# EAGLE design lpc1768 (EAGLE 6.4)
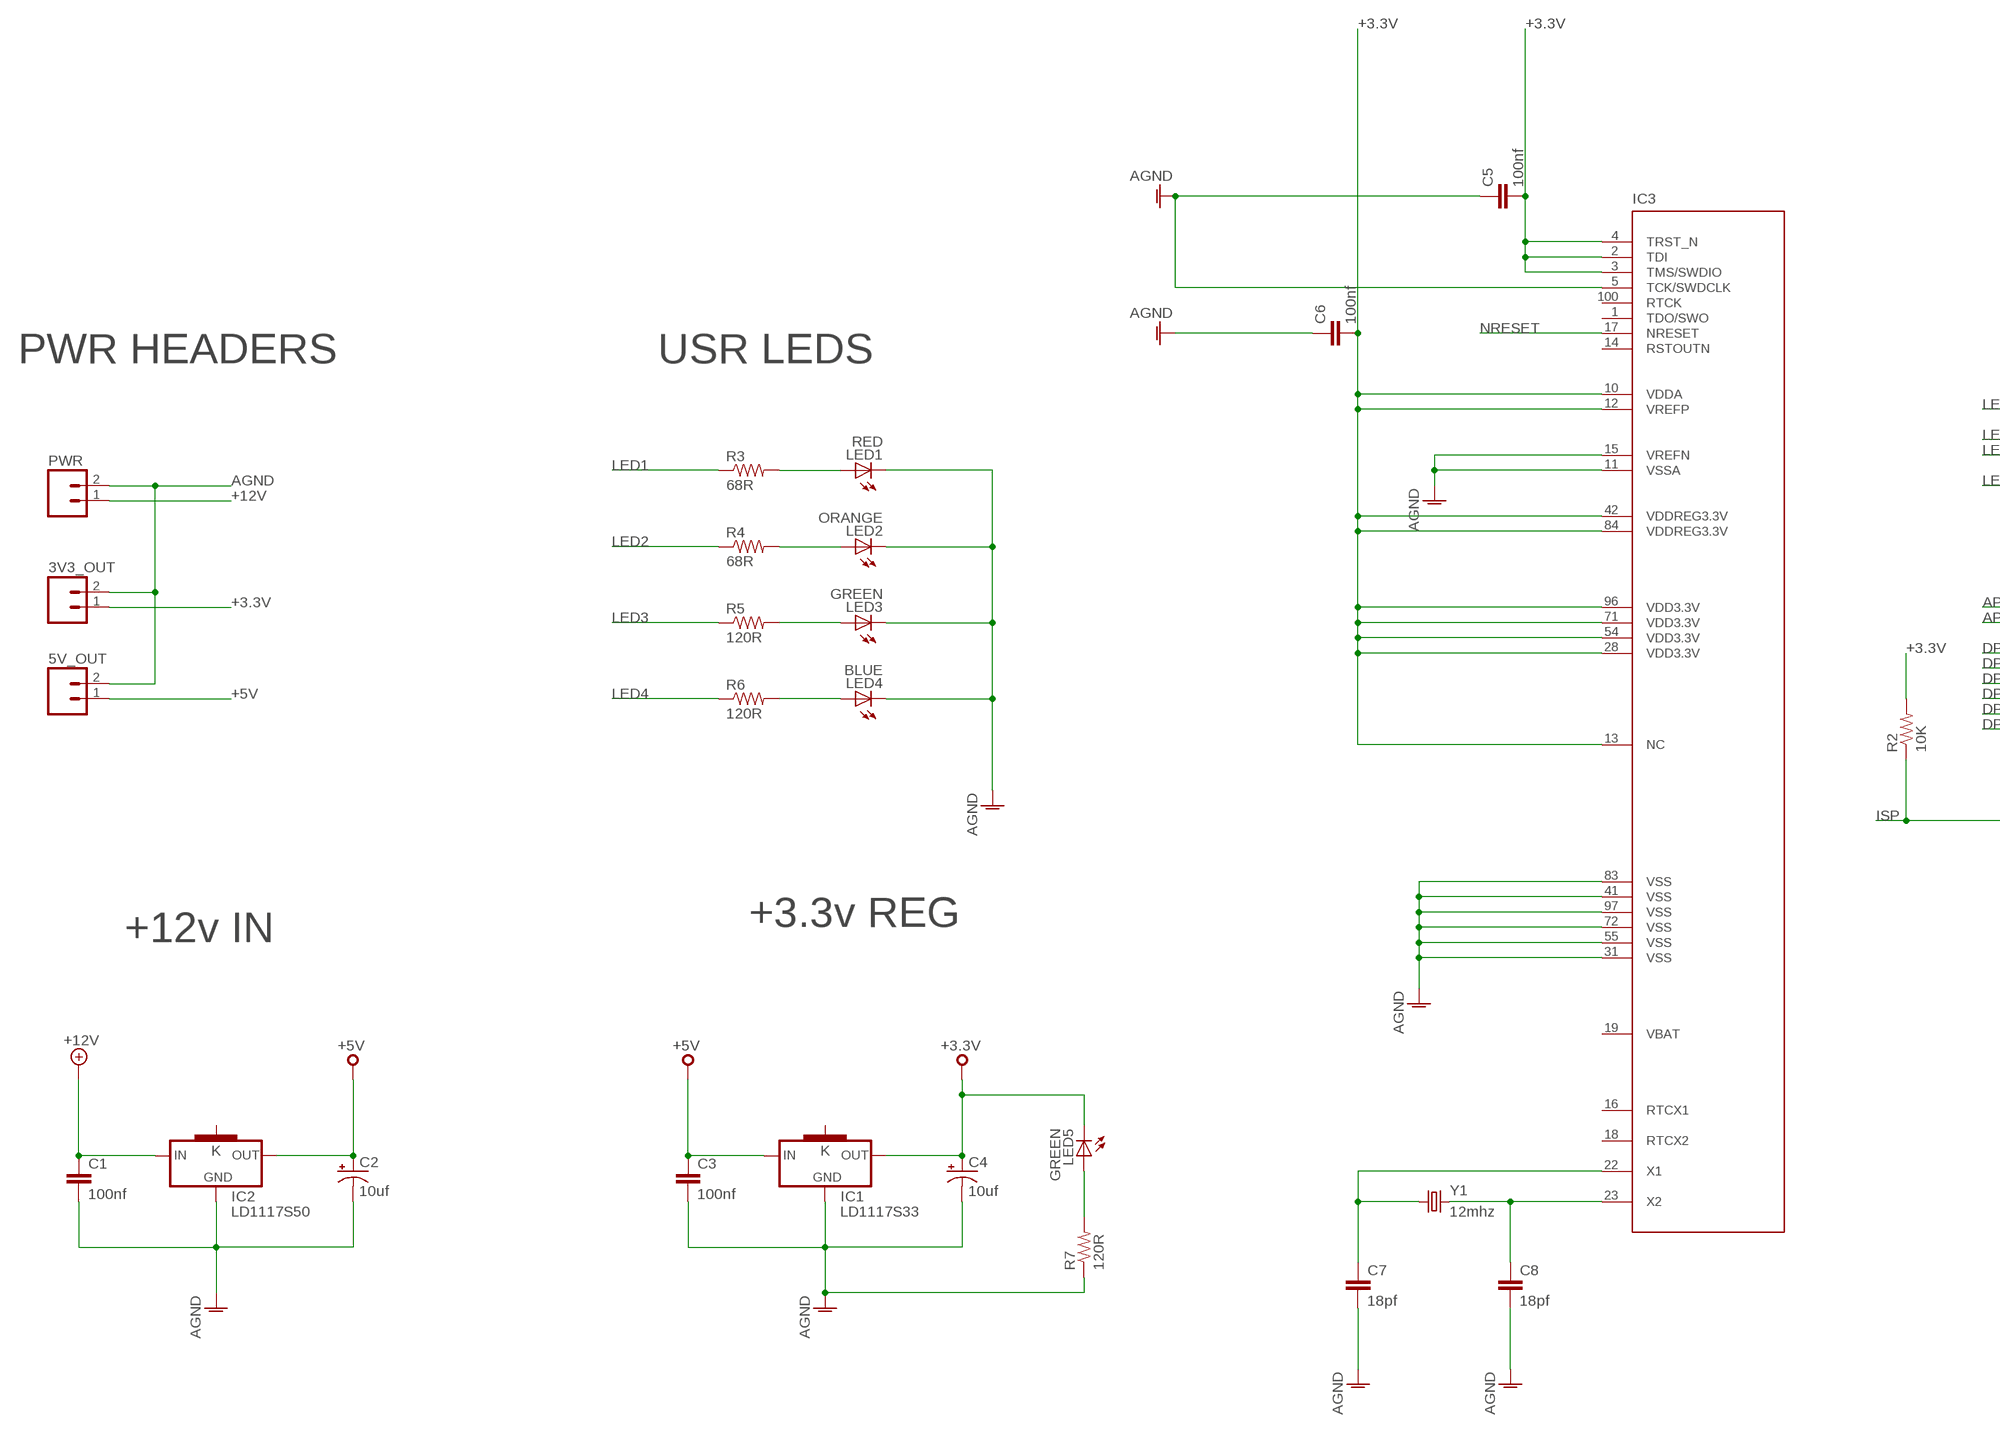
[diagram p0: schematic, sheet 1, part 1 of 2]
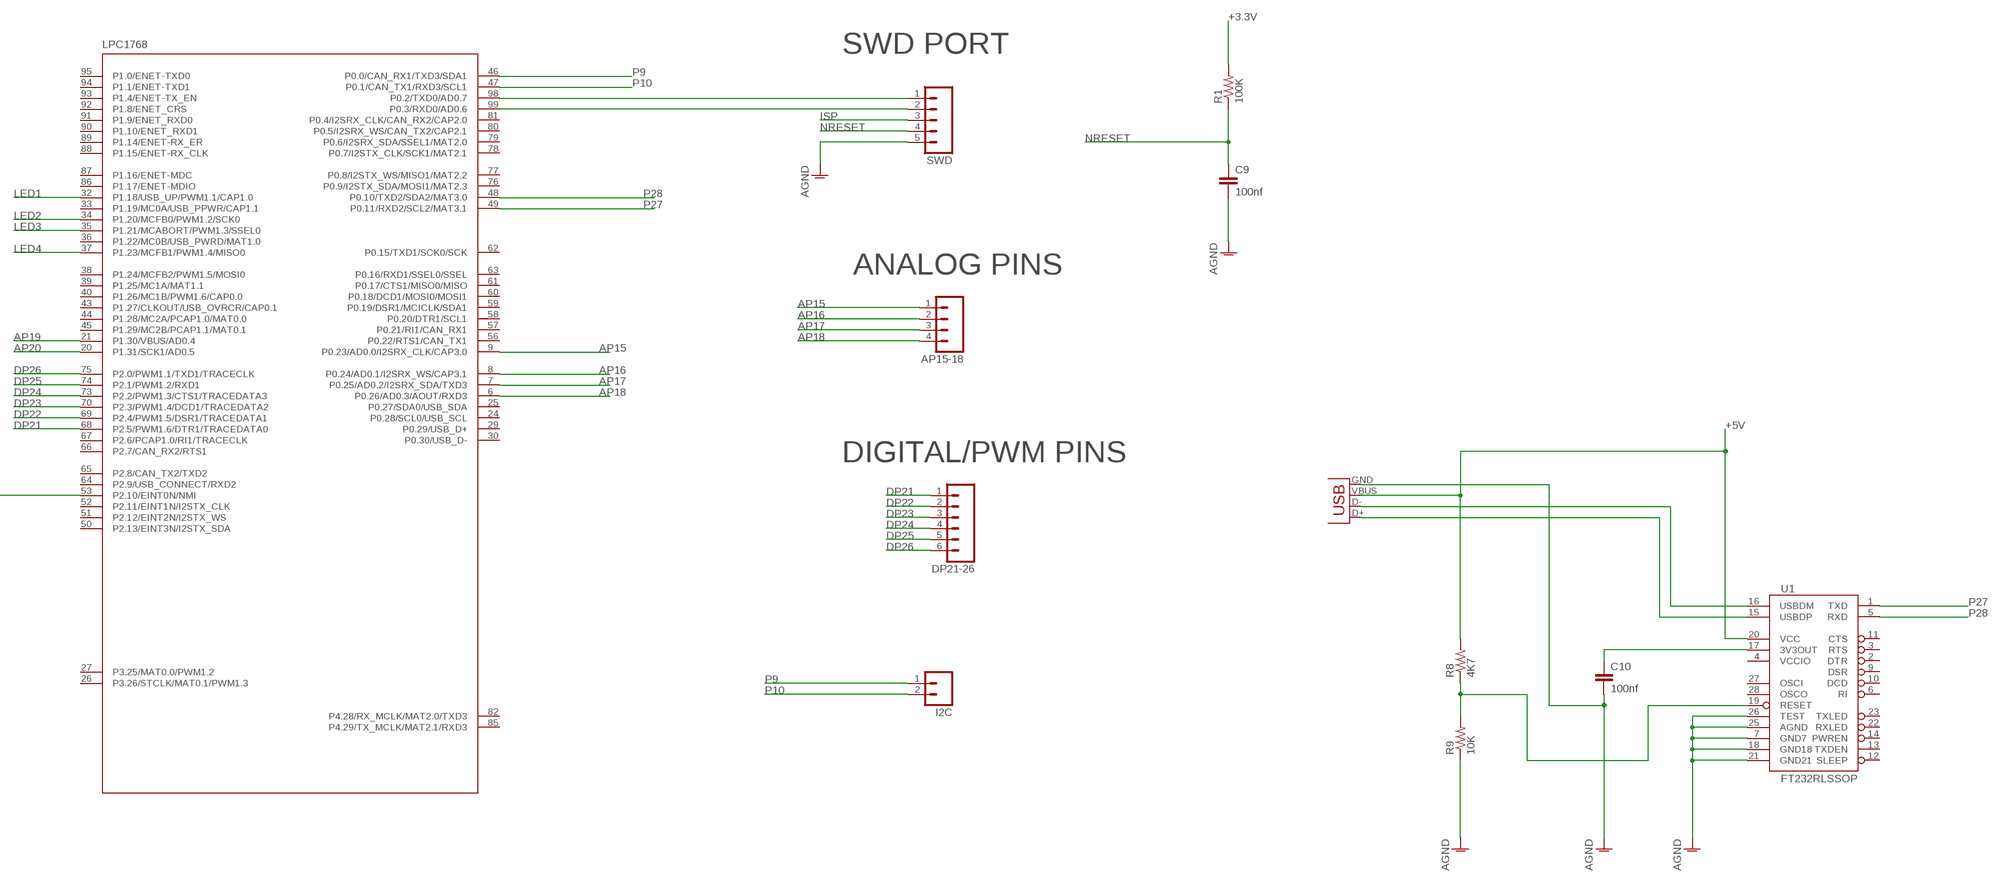
[diagram p1: schematic, sheet 1, part 2 of 2]

## Parts
3V3_OUT  M02PTH3  [1X02_LONGPADS]
5V_OUT  M02PTH3  [1X02_LONGPADS]
AP15-18  M04LONGPADS  [1X04_LONGPADS]
C1  100nf  CAP1206  [1206]
C2  10uf  CAP_POL1206-KIT  [EIA3216-KIT]
C3  100nf  CAP1206  [1206]
C4  10uf  CAP_POL1206-KIT  [EIA3216-KIT]
C5  100nf  CAP1206  [1206]
C6  100nf  CAP1206  [1206]
C7  18pf  CAP1206  [1206]
C8  18pf  CAP1206  [1206]
C9  100nf  CAP1206  [1206]
C10  100nf  CAP1206  [1206]
DP21-26  M06LONGPADS  [1X06_LONGPADS]
I2C  M02PTH3  [1X02_LONGPADS]
IC1  LD1117S33  [SOT223]
IC2  LD1117S50  [SOT223]
IC3  LPC1768  [LQFP100]
LED1  RED  LED1206  [LED-1206]
LED2  ORANGE  LED1206  [LED-1206]
LED3  GREEN  LED1206  [LED-1206]
LED4  BLUE  LED1206  [LED-1206]
LED5  GREEN  LED1206  [LED-1206]
PWR  M02PTH3  [1X02_LONGPADS]
R1  100K  RESISTOR1206  [1206]
R2  10K  RESISTOR1206  [1206]
R3  68R  RESISTOR1206  [1206]
R4  68R  RESISTOR1206  [1206]
R5  120R  RESISTOR1206  [1206]
R6  120R  RESISTOR1206  [1206]
R7  120R  RESISTOR1206  [1206]
R8  4K7  RESISTOR1206  [1206]
R9  10K  RESISTOR1206  [1206]
SWD  M05PTH_LONGPADS  [1X05_LONGPADS]
U1  FT232RLSSOP  [SSOP28DB]
X1  USB-MB-S  [USB-MB-S]
Y1  12mhz  CRYSTAL5X3  [CRYSTAL-SMD-5X3]

## Nets
+3.3V: 3V3_OUT.1 C4.A(+) C5.2 C6.2 IC1.2(OUT) IC3.2(TDI) IC3.3(TMS/SWDIO) IC3.4(TRST_N) IC3.10(VDDA) IC3.12(VREFP) IC3.13(NC) IC3.28(VDD3.3V) IC3.42(VDDREG3.3V) IC3.54(VDD3.3V) IC3.71(VDD3.3V) IC3.84(VDDREG3.3V) IC3.96(VDD3.3V) LED5.C R1.2 R2.2
+5V: 5V_OUT.1 C2.A(+) C3.1 IC1.3(IN) IC2.2(OUT) R8.2 U1.20(VCC) X1.VBUS
+12V: C1.1 IC2.3(IN) PWR.1
AGND: 3V3_OUT.2 5V_OUT.2 C1.2 C2.C(-) C3.2 C4.C(-) C5.1 C6.1 C7.2 C8.2 C9.2 C10.2 IC1.1(GND) IC2.1(GND) IC3.5(TCK/SWDCLK) IC3.11(VSSA) IC3.15(VREFN) IC3.31(VSS) IC3.41(VSS) IC3.55(VSS) IC3.72(VSS) IC3.83(VSS) IC3.97(VSS) LED1.C LED2.C LED3.C LED4.C PWR.2 R7.1 R9.1 SWD.5 U1.7(GND7) U1.18(GND18) U1.21(GND21) U1.25(AGND) U1.26(TEST) X1.GND
AP15: AP15-18.1 IC3.9(P0.23/AD0.0/I2SRX_CLK/CAP3.0)
AP16: AP15-18.2 IC3.8(P0.24/AD0.1/I2SRX_WS/CAP3.1)
AP17: AP15-18.3 IC3.7(P0.25/AD0.2/I2SRX_SDA/TXD3)
AP18: AP15-18.4 IC3.6(P0.26/AD0.3/AOUT/RXD3)
AP19: IC3.21(P1.30/VBUS/AD0.4)
AP20: IC3.20(P1.31/SCK1/AD0.5)
DP21: DP21-26.1 IC3.68(P2.5/PWM1.6/DTR1/TRACEDATA0)
DP22: DP21-26.2 IC3.69(P2.4/PWM1.5/DSR1/TRACEDATA1)
DP23: DP21-26.3 IC3.70(P2.3/PWM1.4/DCD1/TRACEDATA2)
DP24: DP21-26.4 IC3.73(P2.2/PWM1.3/CTS1/TRACEDATA3)
DP25: DP21-26.5 IC3.74(P2.1/PWM1.2/RXD1)
DP26: DP21-26.6 IC3.75(P2.0/PWM1.1/TXD1/TRACECLK)
ISP: IC3.53(P2.10/EINT0N/NMI) R2.1 SWD.3
LED1: IC3.32(P1.18/USB_UP/PWM1.1/CAP1.0) R3.1
LED2: IC3.34(P1.20/MCFB0/PWM1.2/SCK0) R4.1
LED3: IC3.35(P1.21/MCABORT/PWM1.3/SSEL0) R5.1
LED4: IC3.37(P1.23/MCFB1/PWM1.4/MISO0) R6.1
N$1: C8.1 IC3.23(X2) Y1.3
N$2: C7.1 IC3.22(X1) Y1.1
N$3: IC3.98(P0.2/TXD0/AD0.7) SWD.1
N$4: IC3.99(P0.3/RXD0/AD0.6) SWD.2
N$5: LED1.A R3.2
N$6: LED2.A R4.2
N$7: LED3.A R5.2
N$8: LED4.A R6.2
N$9: LED5.A R7.2
N$10: U1.15(USBDP) X1.D+
N$11: U1.16(USBDM) X1.D-
N$12: C10.1 U1.17(3V3OUT)
N$13: R8.1 R9.2 U1.19(RESET)
NRESET: C9.1 IC3.17(NRESET) R1.1 SWD.4
P9: I2C.1 IC3.46(P0.0/CAN_RX1/TXD3/SDA1)
P10: I2C.2 IC3.47(P0.1/CAN_TX1/RXD3/SCL1)
P27: IC3.49(P0.11/RXD2/SCL2/MAT3.1) U1.1(TXD)
P28: IC3.48(P0.10/TXD2/SDA2/MAT3.0) U1.5(RXD)
Unconnected: IC1.4(K) IC2.4(K) IC3.1(TDO/SWO) IC3.14(RSTOUTN) IC3.16(RTCX1) IC3.18(RTCX2) IC3.19(VBAT) IC3.24(P0.28/SCL0/USB_SCL) IC3.25(P0.27/SDA0/USB_SDA) IC3.26(P3.26/STCLK/MAT0.1/PWM1.3) IC3.27(P3.25/MAT0.0/PWM1.2) IC3.29(P0.29/USB_D+) IC3.30(P0.30/USB_D-) IC3.33(P1.19/MC0A/USB_PPWR/CAP1.1) IC3.36(P1.22/MC0B/USB_PWRD/MAT1.0) IC3.38(P1.24/MCFB2/PWM1.5/MOSI0) IC3.39(P1.25/MC1A/MAT1.1) IC3.40(P1.26/MC1B/PWM1.6/CAP0.0) IC3.43(P1.27/CLKOUT/USB_OVRCR/CAP0.1) IC3.44(P1.28/MC2A/PCAP1.0/MAT0.0) IC3.45(P1.29/MC2B/PCAP1.1/MAT0.1) IC3.50(P2.13/EINT3N/I2STX_SDA) IC3.51(P2.12/EINT2N/I2STX_WS) IC3.52(P2.11/EINT1N/I2STX_CLK) IC3.56(P0.22/RTS1/CAN_TX1) IC3.57(P0.21/RI1/CAN_RX1) IC3.58(P0.20/DTR1/SCL1) IC3.59(P0.19/DSR1/MCICLK/SDA1) IC3.60(P0.18/DCD1/MOSI0/MOSI1) IC3.61(P0.17/CTS1/MISO0/MISO) IC3.62(P0.15/TXD1/SCK0/SCK) IC3.63(P0.16/RXD1/SSEL0/SSEL) IC3.64(P2.9/USB_CONNECT/RXD2) IC3.65(P2.8/CAN_TX2/TXD2) IC3.66(P2.7/CAN_RX2/RTS1) IC3.67(P2.6/PCAP1.0/RI1/TRACECLK) IC3.76(P0.9/I2STX_SDA/MOSI1/MAT2.3) IC3.77(P0.8/I2STX_WS/MISO1/MAT2.2) IC3.78(P0.7/I2STX_CLK/SCK1/MAT2.1) IC3.79(P0.6/I2SRX_SDA/SSEL1/MAT2.0) IC3.80(P0.5/I2SRX_WS/CAN_TX2/CAP2.1) IC3.81(P0.4/I2SRX_CLK/CAN_RX2/CAP2.0) IC3.82(P4.28/RX_MCLK/MAT2.0/TXD3) IC3.85(P4.29/TX_MCLK/MAT2.1/RXD3) IC3.86(P1.17/ENET-MDIO) IC3.87(P1.16/ENET-MDC) IC3.88(P1.15/ENET-RX_CLK) IC3.89(P1.14/ENET-RX_ER) IC3.90(P1.10/ENET_RXD1) IC3.91(P1.9/ENET_RXD0) IC3.92(P1.8/ENET_CRS) IC3.93(P1.4/ENET-TX_EN) IC3.94(P1.1/ENET-TXD1) IC3.95(P1.0/ENET-TXD0) IC3.100(RTCK) U1.2(DTR) U1.3(RTS) U1.6(RI) U1.9(DSR) U1.10(DCD) U1.11(CTS) U1.12(SLEEP) U1.13(TXDEN) U1.14(PWREN) U1.22(RXLED) U1.23(TXLED) U1.27(OSCI) U1.28(OSCO)

## Notes on the sheet
- SWD PORT
- PWR HEADERS | USR LEDS
- ANALOG PINS
- DIGITAL/PWM PINS
- +3.3v REG
- +12v IN

## Power pins joined to a net without a drawn wire
VCCIO: U1.4(VCCIO)

## Library data of the parts
3V3_OUT 5V_OUT I2C PWR = SparkFun-Connectors:M02: Header 2 Standard 2-pin 0.1" header. Use with straight break away headers (SKU : PRT-00116), right angle break away headers (PRT-00553), swiss pins (PRT-00743), machine pins (PRT-00117), and female headers (PRT-00115). Molex polarized connector foot print use with SKU : PRT-08233 with associated crimp pins and housings.
AP15-18 = SparkFun-Connectors:M04: Header 4 Standard 4-pin 0.1" header. Use with straight break away headers (SKU : PRT-00116), right angle break away headers (PRT-00553), swiss pins (PRT-00743), machine pins (PRT-00117), and female headers (PRT-00115). Molex polarized connector foot print use with SKU : PRT-08231 with associated crimp pins and housings. 1MM SMD Version SKU: PRT-10208
C1 C3 C5-C10 = SparkFun-Capacitors:CAP: Capacitor Standard 0603 ceramic capacitor, and 0.1" leaded capacitor.
C2 C4 = SparkFun-Capacitors:CAP_POL: Capacitor Polarized These are standard SMD and PTH capacitors. Normally 10uF, 47uF, and 100uF in electrolytic and tantalum varieties. Always verify the external diameter of the through hole cap, it varies with capacity, voltage, and manufacturer. The EIA devices should be standard.
DP21-26 = SparkFun-Connectors:M06: Header 6 Standard 6-pin 0.1" header. Use with straight break away headers (SKU : PRT-00116), right angle break away headers (PRT-00553), swiss pins (PRT-00743), machine pins (PRT-00117), and female headers (PRT-00115). Molex polarized connector foot print use with SKU : PRT-08094 with associated crimp pins and housings. NOTES ON THE VARIANTS LOCK and LOCK_LONGPADS... This footprint was designed to help hold the alignment of a through-hole component (i.e. 6-pin header) while soldering it into place. You may notice that each hole has been shifted either up or down by 0.005 of an inch from it's more standard position (which is a perfectly straight line). This slight alteration caused the pins (the squares in the middle) to touch the edges of the holes. Because they are alternating, it causes a "brace" to hold the component in place. 0.005 has proven to be the perfect amount of "off-center" position when using our standard breakaway headers. Although looks a little odd when you look at the bare footprint, once you have a header in there, the alteration is very hard to notice. Also, if you push a header all the way into place, it is covered up entirely on the bottom side. This idea of altering the position of holes to aid alignment will be further integrated into the Sparkfun Library for other footprints. It can help hold any component with 3 or more connection pins.
IC1 = mbed-ics:LD1117S33: VOLTAGE REGULATOR SMD 3,3V
IC2 = mbed-ics:LD1117S50: VOLTAGE REGULATOR SMD 5V
IC3 = mbed-ics:LPC1768
LED1-LED5 = SparkFun-LED:LED: LEDs Standard schematic elements and footprints for 5mm, 3mm, 1206, and 0603 sized LEDs. 5mm - Spark Fun Electronics SKU : COM-00529 (and others)
R1-R9 = SparkFun-Resistors:RESISTOR: Resistor Basic schematic elements and footprints for 0603, 1206, and PTH resistors.
SWD = SparkFun-Connectors:M05: Header 5 Standard 5-pin 0.1" header. Use with straight break away headers (SKU : PRT-00116), right angle break away headers (PRT-00553), swiss pins (PRT-00743), machine pins (PRT-00117), and female headers (PRT-00115). Molex polarized connector foot print use with SKU : PRT-08230 with associated crimp pins and housings.
U1 = SparkFun-DigitalIC:FT232RL: USB UART FT232RL 4th Generation USB UART (USB <-> Serial) Controller. Spark Fun Electronics SKU : COM-00650 Production SKU IC-00870; PROD_ID: IC-00870
X1 = mbed-connectors:USB: USB Connectors
Y1 = SparkFun-FreqCtrl:CRYSTAL: Various standard crystals. Proven footprints. Spark Fun Electronics SKU : COM-00534

## Board
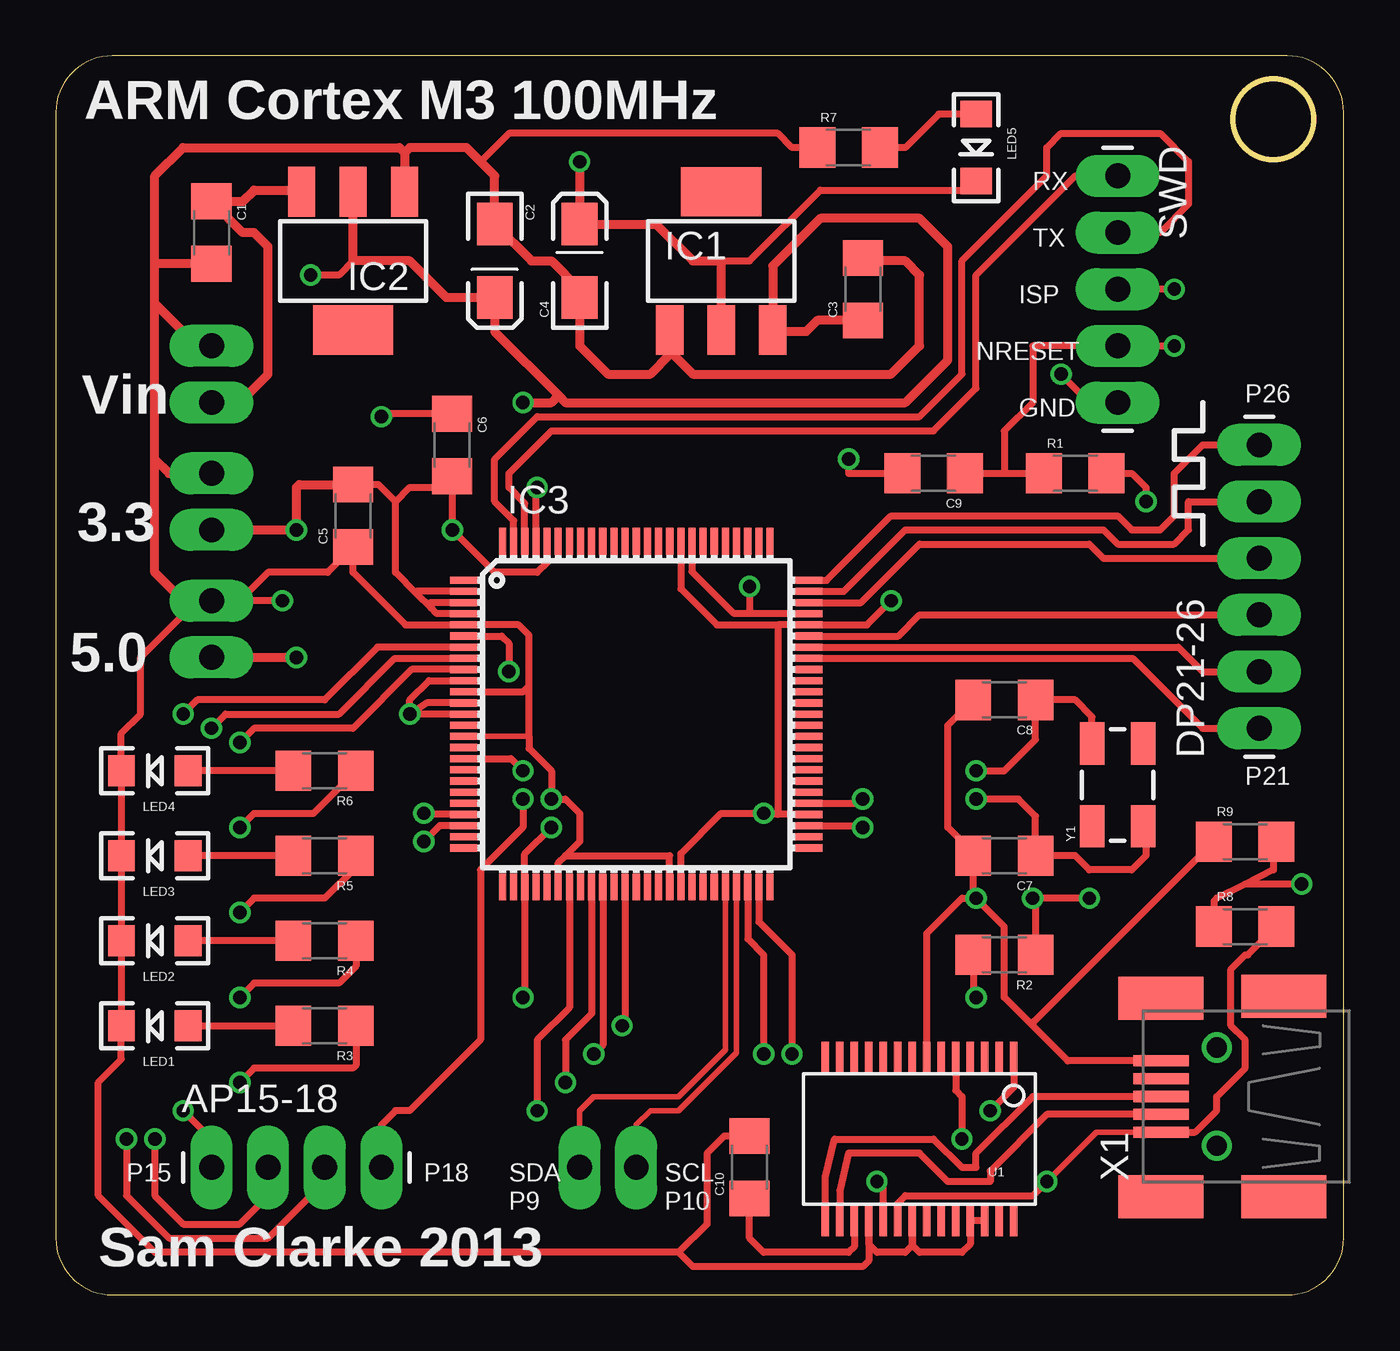
[diagram p2: board, top side]
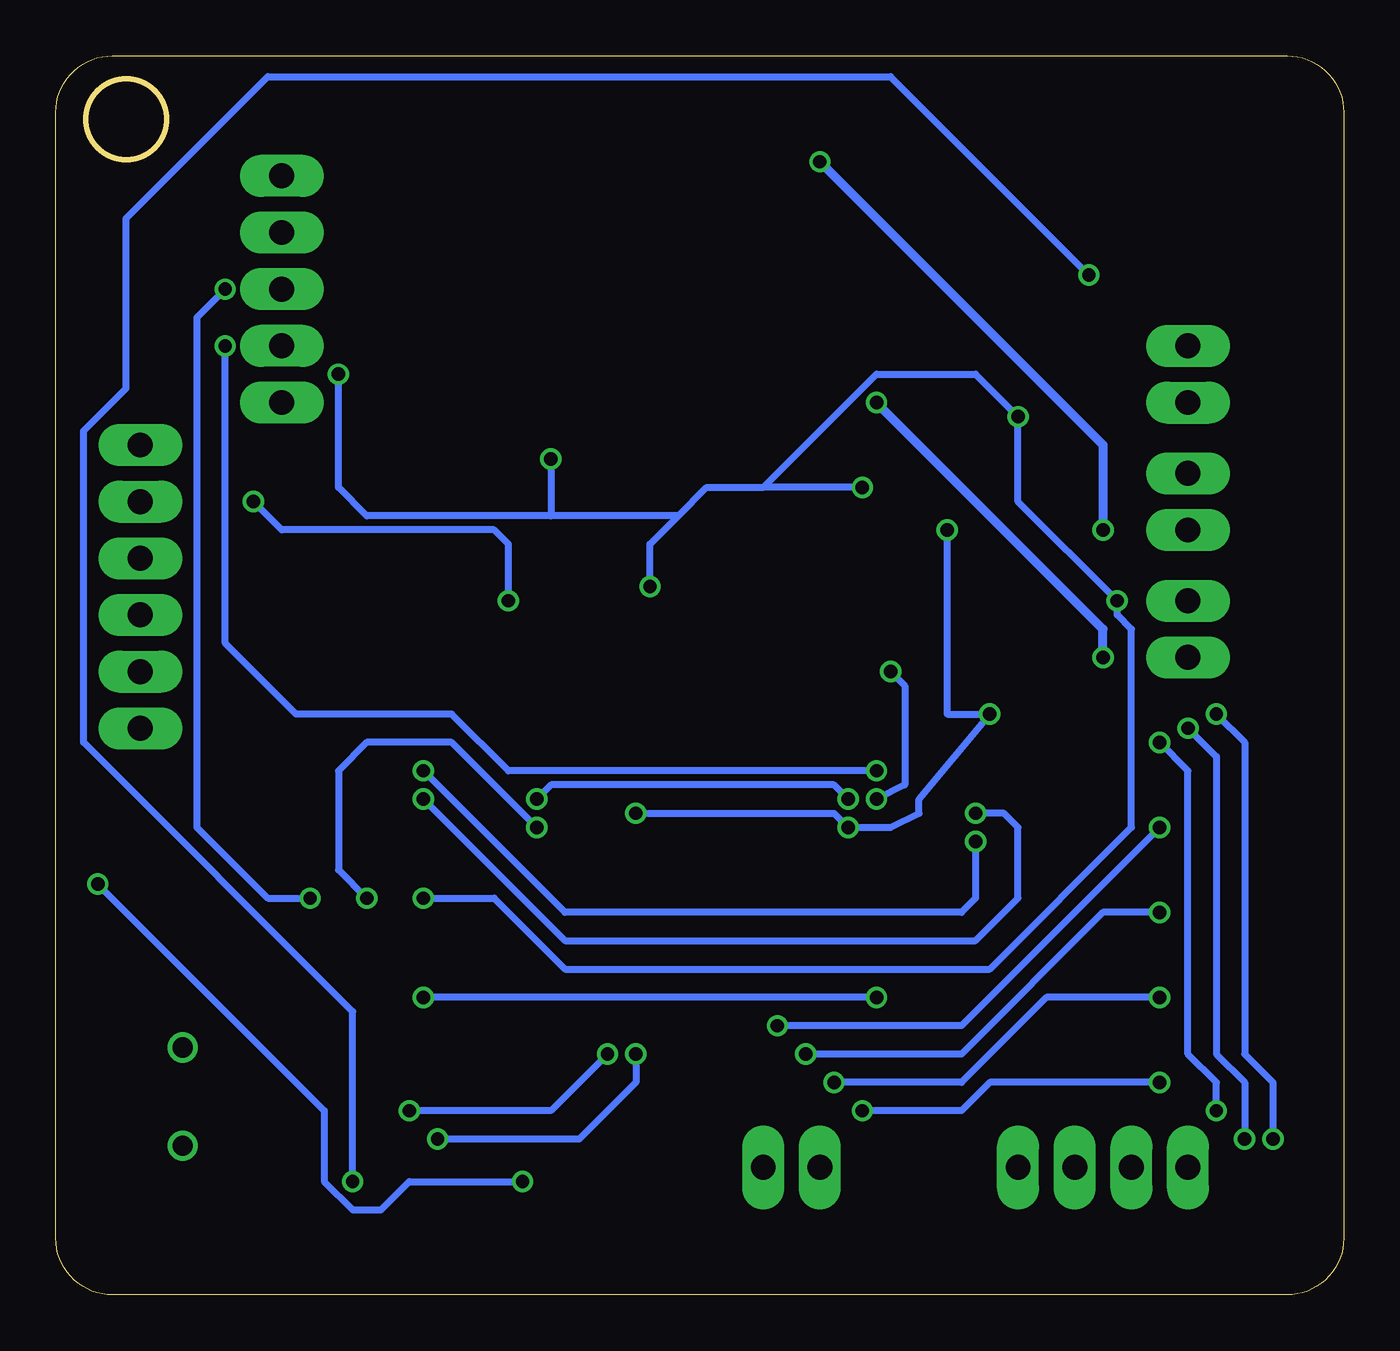
[diagram p3: board, bottom side, seen from below]

Size 57.77 x 55.55 mm. Coordinates in mm from the lower left corner, seen from the top.
Outline: 57.77,2.54 57.77,53.01 arc90 55.23,55.55 2.54,55.55 arc90 0,53.01 0,2.54 arc90 2.54,0 55.23,0 arc90 57.77,2.54
Outline: circle at 54.61,52.7 radius 1.8
Copper layers (1*16): Top 0.0356mm / dielectric 1.5011mm / Bottom 0.0356mm
Design rules "OSHpark": minimum track width 6mil, minimum drill 13mil, track to track 6mil, track to pad 6mil, pad to pad 6mil, via to via 6mil, smd to smd 6mil, copper to edge 15mil, drill to drill 6mil, minimum pad ring 7mil, minimum via ring 7mil, stop-mask expansion 4mil, vias tented up to drill 0mil, thermal gap 10mil

### Footprints (pad centres in the part's own frame; a part is rotated, then mirrored left to right if it is on the bottom)
1X02_LONGPADS = drill 1.118 pad 1.88 long: 1 0,0; 2 2.54,0
1X04_LONGPADS = drill 1.118 pad 1.88 long: 1 0,0; 2 2.54,0; 3 5.08,0; 4 7.62,0
1206 = smd 1.6 x 1.8: 1 -1.4,0; 2 1.4,0
EIA3216-KIT = smd 1.9 x 1.6: A 1.65,0; C -1.65,0
1X06_LONGPADS = drill 1.118 pad 1.88 long: 1 0,0; 2 2.54,0; 3 5.08,0; 4 7.62,0; 5 10.16,0; 6 12.7,0
SOT223 = smd 1.219 x 2.235: 1 -2.311,-3.099; 2 0,-3.099; 3 2.311,-3.099 | smd 3.6 x 2.2: 4 0,3.099
LQFP100 = smd 1.2 x 0.32: 1 -7.75,6; 2 -7.75,5.5; 3 -7.75,5; 4 -7.75,4.5; 5 -7.75,4; 6 -7.75,3.5; 7 -7.75,3; 8 -7.75,2.5; 9 -7.75,2; 10 -7.75,1.5; 11 -7.75,1; 12 -7.75,0.5; 13 -7.75,0; 14 -7.75,-0.5; 15 -7.75,-1; 16 -7.75,-1.5; 17 -7.75,-2; 18 -7.75,-2.5; 19 -7.75,-3; 20 -7.75,-3.5; 21 -7.75,-4; 22 -7.75,-4.5; 23 -7.75,-5; 24 -7.75,-5.5; 25 -7.75,-6; 51 7.75,-6; 52 7.75,-5.5; 53 7.75,-5; 54 7.75,-4.5; 55 7.75,-4; 56 7.75,-3.5; 57 7.75,-3; 58 7.75,-2.5; 59 7.75,-2; 60 7.75,-1.5; 61 7.75,-1; 62 7.75,-0.5; 63 7.75,0; 64 7.75,0.5; 65 7.75,1; 66 7.75,1.5; 67 7.75,2; 68 7.75,2.5; 69 7.75,3; 70 7.75,3.5; 71 7.75,4; 72 7.75,4.5; 73 7.75,5; 74 7.75,5.5; 75 7.75,6 | smd 0.32 x 1.2: 26 -6,-7.75; 27 -5.5,-7.75; 28 -5,-7.75; 29 -4.5,-7.75; 30 -4,-7.75; 31 -3.5,-7.75; 32 -3,-7.75; 33 -2.5,-7.75; 34 -2,-7.75; 35 -1.5,-7.75; 36 -1,-7.75; 37 -0.5,-7.75; 38 0,-7.75; 39 0.5,-7.75; 40 1,-7.75; 41 1.5,-7.75; 42 2,-7.75; 43 2.5,-7.75; 44 3,-7.75; 45 3.5,-7.75; 46 4,-7.75; 47 4.5,-7.75; 48 5,-7.75; 49 5.5,-7.75; 50 6,-7.75; 76 6,7.75; 77 5.5,7.75; 78 5,7.75; 79 4.5,7.75; 80 4,7.75; 81 3.5,7.75; 82 3,7.75; 83 2.5,7.75; 84 2,7.75; 85 1.5,7.75; 86 1,7.75; 87 0.5,7.75; 88 0,7.75; 89 -0.5,7.75; 90 -1,7.75; 91 -1.5,7.75; 92 -2,7.75; 93 -2.5,7.75; 94 -3,7.75; 95 -3.5,7.75; 96 -4,7.75; 97 -4.5,7.75; 98 -5,7.75; 99 -5.5,7.75; 100 -6,7.75
LED-1206 = smd 1.2 x 1.4: A -1.5,0; C 1.5,0
1X05_LONGPADS = drill 1.118 pad 1.88 long: 1 0,0; 2 2.54,0; 3 5.08,0; 4 7.62,0; 5 10.16,0
SSOP28DB = smd 0.348 x 1.397: 1 -4.225,-3.656; 2 -3.575,-3.656; 3 -2.925,-3.656; 4 -2.275,-3.656; 5 -1.625,-3.656; 6 -0.975,-3.656; 7 -0.325,-3.656; 8 0.325,-3.656; 9 0.975,-3.656; 10 1.625,-3.656; 11 2.275,-3.656; 12 2.925,-3.656; 13 3.575,-3.656; 14 4.225,-3.656; 15 4.225,3.656; 16 3.575,3.656; 17 2.925,3.656; 18 2.275,3.656; 19 1.625,3.656; 20 0.975,3.656; 21 0.325,3.656; 22 -0.325,3.656; 23 -0.975,3.656; 24 -1.625,3.656; 25 -2.275,3.656; 26 -2.925,3.656; 27 -3.575,3.656; 28 -4.225,3.656
USB-MB-S = smd 2.5 x 0.5: D+ 2.5,0; D- 2.5,0.8; GND 2.5,-1.6; ID 2.5,-0.8; VBUS 2.5,1.6 | smd 3.81 x 1.93: GND@1 -3,4.5; GND@2 2.5,4.5; GND@3 -3,-4.5; GND@4 2.5,-4.4 | drill 0.9: P$5 0,2.2; P$6 0,-2.2
CRYSTAL-SMD-5X3 = smd 1.9 x 1.1: 1 -1.85,-1.15; 2 1.85,-1.15; 3 1.85,1.15; 4 -1.85,1.15

### Placement (x,y rotation side)
3V3_OUT  6.99,34.29 90 top
5V_OUT  6.99,28.57 90 top
AP15-18  6.99,5.71 0 top
C1  6.99,47.62 270 top
C2  19.68,46.35 270 top
C3  36.2,45.09 90 top
C4  23.5,46.35 90 top
C5  13.34,34.92 90 top
C6  17.78,38.1 270 top
C7  42.55,19.68 180 top
C8  42.55,26.67 180 top
C9  39.37,36.83 180 top
C10  31.11,5.71 90 top
DP21-26  53.98,25.4 90 top
I2C  23.5,5.71 0 top
IC1  29.84,46.35 0 top
IC2  13.34,46.35 180 top
IC3  26.04,26.04 0 top
LED1  4.45,12.06 180 top
LED2  4.45,15.88 180 top
LED3  4.45,19.68 180 top
LED4  4.45,23.5 180 top
LED5  41.27,51.44 270 top
PWR  6.99,40.01 90 top
R1  45.72,36.83 0 top
R2  42.55,15.24 180 top
R3  12.06,12.06 180 top
R4  12.06,15.88 180 top
R5  12.06,19.68 180 top
R6  12.06,23.5 180 top
R7  35.56,51.44 0 top
R8  53.34,16.51 0 top
R9  53.34,20.32 0 top
SWD  47.62,50.16 270 top
U1  38.73,6.99 180 top
X1  52.07,8.89 180 top
Y1  47.62,22.86 90 top

### Tracks (layer width: path | path; a pad name or v marks a point on that pad's centre or on a via)
+3.3V  (via drill 0.6)
  Top 0.305: IC3.4 17.09,30.54 16.83,30.8 | 16.83,30.8 16.19,31.43 | 16.19,31.43 15.24,32.38 15.24,35.56 | 15.24,35.56 14.47,36.33 C5.2 | IC3.3 16.83,31.04 16.83,30.8 | IC3.2 16.19,31.54 16.19,31.43 | C6.2 17.78,36.2 | 17.78,36.2 v17.78,34.29 19.68,32.38 21.59,32.38 22.04,32.83 IC3.96 | 15.24,35.56 15.88,36.2 17.78,36.2 | IC3.12 16.64,26.54 v15.88,26.04 | IC3.54 32.38,21.54 | 32.38,21.54 31.8,21.54 arc-90 v31.75,21.59 | 32.38,30.04 IC3.71 36.38,30.04 v37.47,31.11 | 32.38,30.04 32.38,21.54 | IC3.42 28.04,19.78 29.84,21.59 32.33,21.59 32.38,21.54 | v20.95,13.34 21.04,13.41 IC3.28 21.04,19.77 v22.23,20.95 | R2.2 41.15,13.46 v41.27,13.34 | 29.84,46.35 31.11,46.35 34.29,49.53 40.87,49.53 LED5.C | v15.88,26.04 15.88,26.67 16.74,27.54 IC3.10 | IC3.13 v15.88,26.04 | R1.2 48.26,36.83 48.9,36.2 v48.9,35.56 | IC3.84 28.04,31.66 29.66,30.04 32.38,30.04
  Top 0.406: IC1.2 29.84,46.35 28.57,46.35 26.93,48.01 C4.A v23.5,50.8 | 3V3_OUT.1 v10.79,34.29 10.79,36.2 10.93,36.33 C5.2
  Bottom 0.305: v17.78,34.29 17.78,26.04 v15.88,26.04 19.05,22.23 19.05,21.59 20.32,20.95 v22.23,20.95 22.86,21.59 v31.75,21.59 | v20.95,13.34 v41.27,13.34 | v37.47,31.11 37.47,33.66 38.1,34.29 47.62,34.29 v48.9,35.56
  Bottom 0.406: v23.5,50.8 10.79,38.1 v10.79,34.29
+5V  (via drill 0.6)
  Top 0.254: X1.VBUS 46.66,7.29 v44.45,5.08
  Top 0.305: U1.20 37.76,4.11 38.1,4.45 43.81,4.45 v44.45,5.08 | X1.VBUS 51.1,7.29 52.07,8.26 52.07,8.89 53.34,10.16 53.34,11.43 52.7,12.06 52.7,14.61 53.34,15.24 53.47,15.24 R8.2 | 13.34,46.35 12.7,45.72 v11.43,45.72
  Top 0.406: IC2.2 13.34,46.35 15.88,46.35 17.52,44.7 C2.A 19.68,43.18 22.54,40.32 | C3.1 34.16,43.69 33.66,43.18 32.23,43.18 arc-90 IC1.3 32.16,46.13 34.29,48.26 38.73,48.26 40.01,46.99 40.01,41.91 38.1,40.01 22.86,40.01 22.54,40.32 | 5V_OUT.1 v10.79,28.57 | v20.95,40.01 22.23,40.01 22.54,40.32
  Bottom 0.305: v44.45,5.08 44.45,12.7 56.52,24.77 56.52,38.73 54.61,40.64 54.61,48.26 48.26,54.61 20.32,54.61 v11.43,45.72
  Bottom 0.406: v10.79,28.57 10.79,29.84 v20.95,40.01
+12V
  Top 0.406: IC2.3 arc90 10.95,49.53 8.89,49.53 8.38,49.02 C1.1 8.38,47.62 8.89,47.62 9.53,46.99 9.53,41.27 8.26,40.01 PWR.1
AGND  (via drill 0.6)
  Top 0.254: IC3.15 21.23,25.04
  Top 0.305: C6.1 14.73,39.5 v14.61,39.37 | v10.16,31.11 5V_OUT.2 8.26,31.11 9.53,32.38 12.2,32.38 C5.1 13.34,32.38 15.69,30.04 IC3.5 20.77,30.04 21.23,29.57 21.23,27.3 | IC3.41 27.54,19.68 22.86,19.68 | IC3.97 21.54,36.14 v21.59,36.2 | IC3.55 36.01,22.04 arc90 v36.2,22.23 | IC3.31 22.54,19.36 22.86,19.68 | C8.2 40.01,25.53 40.01,20.95 41.15,19.82 C7.2 41.15,17.91 v41.27,17.78 | SWD.5 46.35,40.01 v45.09,41.27 | 37.47,36.83 C9.2 35.56,36.83 v35.56,37.47 | 6.35,31.11 3.81,28.57 3.81,26.04 2.94,25.17 LED4.C LED3.C LED2.C LED1.C 2.94,10.56 1.91,9.53 1.91,4.45 4.45,1.91 27.94,1.91 | R7.1 33.02,51.44 32.38,52.07 20.32,52.07 19.05,50.8 | C10.2 29.98,7.12 29.21,6.35 29.21,3.17 27.94,1.91 | X1.GND 45.39,10.49 43.81,12.06 | 43.81,12.06 42.55,13.34 42.55,16.51 v41.27,17.78 | U1.7 39.06,16.2 40.64,17.78 v41.27,17.78 | U1.26 U1.25 41.01,2.27 40.64,1.91 38.73,1.91 38.41,2.23 U1.21 38.41,2.21 38.1,1.91 36.83,1.91 36.46,2.27 U1.18 36.46,1.53 36.2,1.27 28.57,1.27 27.94,1.91 | 43.81,12.06 arc-45 43.91,12.29 R9.1 | 22.86,19.68 23.5,20.32 23.5,21.59 22.86,22.23 v22.23,22.23 22.23,23.5 21.23,24.5 21.23,25.04 21.23,27.3 | IC3.11 20.95,27.04 21.23,27.3 | IC3.83 28.54,32.42 30.43,30.54 31.11,30.54 | IC3.72 31.11,30.54 | v31.11,31.75 31.11,30.54
  Top 0.406: 15.65,51.21 15.88,51.44 18.41,51.44 19.05,50.8 19.68,50.16 C2.C 21.34,46.35 22.23,46.35 23.5,45.09 C4.C 23.5,42.55 24.77,41.27 26.67,41.27 27.53,42.14 IC1.1 27.53,42.32 28.57,41.27 37.47,41.27 38.73,42.55 38.73,45.72 38.1,46.35 36.33,46.35 arc-90 C3.2 | 15.65,51.21 IC2.1 | C1.2 4.45,46.23 | 4.45,46.23 4.45,50.16 5.71,51.44 15.42,51.44 15.65,51.21 | PWR.2 6.35,42.55 4.45,44.45 | 4.45,44.45 4.45,46.23 | 3V3_OUT.2 5.08,36.83 4.45,37.47 | 4.45,37.47 4.45,44.45 | 5V_OUT.2 6.35,31.11 5.71,31.11 4.45,32.38 4.45,37.47
  Bottom 0.305: v36.2,22.23 35.56,22.86 22.86,22.86 v22.23,22.23 | v45.09,41.27 45.09,36.2 43.81,34.92 35.56,34.92 | 26.04,36.2 28.57,36.2 29.84,34.92 | v21.59,36.2 26.04,36.2 | v41.27,17.78 38.1,17.78 34.92,14.61 15.88,14.61 9.53,20.95 9.53,29.84 10.16,30.48 v10.16,31.11 14.61,35.56 v14.61,39.37 16.51,41.27 20.95,41.27 26.04,36.2 | v31.11,31.75 31.11,33.66 29.84,34.92 | 29.84,34.92 35.56,34.92 | v35.56,37.47 35.56,34.92
AP15  (via drill 0.6)
  Top 0.305: IC3.9 15.97,28.04 13.34,25.4 8.89,25.4 v8.26,24.77 | v5.71,8.26 6.99,6.99 AP15-18.1
  Bottom 0.305: v5.71,8.26 5.71,9.53 6.99,10.79 6.99,23.5 v8.26,24.77
AP16  (via drill 0.6)
  Top 0.305: v6.99,25.4 7.62,26.04 12.7,26.04 15.2,28.54 IC3.8 | v4.45,6.99 4.45,4.45 5.71,3.17 8.26,3.17 9.53,4.45 AP15-18.2
  Bottom 0.305: v6.99,25.4 5.71,24.13 5.71,10.79 4.45,9.53 v4.45,6.99
AP17  (via drill 0.6)
  Top 0.305: IC3.7 14.43,29.04 12.06,26.67 6.35,26.67 v5.71,26.04 | v3.17,6.99 3.17,4.45 5.08,2.54 9.53,2.54 12.06,5.08 AP15-18.3
  Bottom 0.305: v5.71,26.04 4.45,24.77 4.45,10.79 3.17,9.53 v3.17,6.99
AP18  (via drill 0.6)
  Top 0.305: IC3.6 20,29.54 20.32,29.21 v20.32,27.94 | v20.95,22.23 20.95,20.95 19.05,19.05 19.05,11.43 15.88,8.26 15.24,8.26 14.61,7.62 AP15-18.4
  Bottom 0.305: v20.32,27.94 19.68,27.3 19.68,22.86 v20.95,22.23
DP21
  Top 0.305: IC3.68 48.3,28.54 51.44,25.4 DP21-26.1
DP22
  Top 0.305: IC3.69 50.34,29.04 51.44,27.94 DP21-26.2
DP23
  Top 0.305: IC3.70 37.79,29.54 38.73,30.48 DP21-26.3
DP24
  Top 0.305: IC3.73 36.12,31.04 38.73,33.66 46.35,33.66 46.99,33.02 DP21-26.4
DP25
  Top 0.305: IC3.74 35.34,31.54 38.1,34.29 46.99,34.29 47.62,33.66 50.16,33.66 50.8,34.29 50.8,35.56 DP21-26.5
DP26
  Top 0.305: IC3.75 34.58,32.03 37.47,34.92 47.62,34.92 48.26,34.29 49.53,34.29 50.16,34.92 50.16,36.83 51.44,38.1 DP21-26.6
ISP  (via drill 0.6)
  Top 0.305: IC3.53 36.12,21.04 v36.2,20.95 | R2.1 43.95,17.65 v43.81,17.78 v46.35,17.78 | v50.16,45.09 SWD.3
  Bottom 0.305: v36.2,20.95 40.01,24.77 43.81,24.77 45.09,23.5 45.09,19.05 v43.81,17.78 | v50.16,45.09 51.44,43.81 51.44,20.95 48.26,17.78 v46.35,17.78
LED1  (via drill 0.6)
  Top 0.305: IC3.32 23.04,12.88 21.59,11.43 v21.59,8.26 | R3.1 13.46,10.29 13.34,10.16 8.89,10.16 v8.26,9.53
  Bottom 0.305: v8.26,9.53 15.88,9.53 17.14,8.26 v21.59,8.26
LED2  (via drill 0.6)
  Top 0.305: IC3.34 24.04,12.61 22.86,11.43 v22.86,9.53 | R4.1 13.46,14.73 12.7,13.97 8.89,13.97 v8.26,13.34
  Bottom 0.305: v8.26,13.34 13.34,13.34 17.14,9.53 v22.86,9.53
LED3  (via drill 0.6)
  Top 0.305: IC3.35 24.54,11.2 v24.13,10.79 | R5.1 13.46,19.18 12.06,17.78 8.89,17.78 v8.26,17.14
  Bottom 0.305: v8.26,17.14 10.79,17.14 17.14,10.79 v24.13,10.79
LED4  (via drill 0.6)
  Top 0.305: IC3.37 25.54,12.2 v25.4,12.06 | v8.26,20.95 8.89,21.59 11.56,21.59 R6.1
  Bottom 0.305: v8.26,20.95 17.14,12.06 v25.4,12.06
N$1  (via drill 0.6)
  Top 0.305: IC3.23 17.23,21.04 v16.51,20.32 | Y1.3 46.48,25.91 45.72,26.67 C8.1 43.95,24.89 42.55,23.5 v41.27,23.5
  Bottom 0.305: v16.51,20.32 16.51,17.78 17.14,17.14 34.92,17.14 v41.27,23.5
N$2  (via drill 0.6)
  Top 0.305: IC3.22 16.57,21.54 v16.51,21.59 | v41.27,22.23 43.18,22.23 43.95,21.46 C7.1 45.72,19.68 46.35,19.05 48.26,19.05 48.9,19.68 48.9,20.95 48.84,21.01 Y1.1
  Bottom 0.305: v41.27,22.23 34.92,15.88 16.51,15.88 14.61,17.78 14.61,20.95 15.24,21.59 v16.51,21.59
N$3
  Top 0.305: IC3.98 21.04,35.48 20.32,36.2 20.32,36.83 22.23,38.73 39.37,38.73 41.27,40.64 41.27,45.72 45.72,50.16 SWD.1
N$4
  Top 0.305: IC3.99 20.54,34.71 19.68,35.56 19.68,37.47 21.59,39.37 38.73,39.37 40.64,41.27 40.64,46.35 44.45,50.16 44.45,51.44 45.09,52.07 49.53,52.07 50.8,50.8 50.8,48.9 49.53,47.62 SWD.2
N$5
  Top 0.305: LED1.A R3.2
N$6
  Top 0.305: R4.2 LED2.A
N$7
  Top 0.305: R5.2 LED3.A
N$8
  Top 0.305: R6.2 LED4.A
N$9
  Top 0.305: LED5.A 39.6,52.94 38.1,51.44 R7.2
N$10
  Top 0.305: X1.D+ 43.81,8.89 41.27,6.35 41.27,5.71 40.64,5.71 39.37,6.99 34.92,6.99 34.51,5.3 U1.15
N$11
  Top 0.305: X1.D- 44.45,8.09 41.91,5.55 41.91,5.08 40.01,5.08 38.73,6.35 35.56,6.35 35.16,4.68 U1.16
N$12
  Top 0.305: U1.17 35.81,2.15 35.56,1.91 31.75,1.91 31.11,2.54 C10.1
N$13  (via drill 0.6)
  Top 0.305: R9.2 54.61,20.19 54.61,19.05 53.34,18.41 | 53.34,18.41 52.07,17.78 51.94,17.65 R8.1 | U1.19 37.11,4.8 v36.83,5.08 | v55.88,18.41 53.34,18.41
  Bottom 0.305: v55.88,18.41 45.72,8.26 45.72,5.08 44.45,3.81 43.18,3.81 41.91,5.08 v36.83,5.08
NRESET  (via drill 0.6)
  Top 0.305: C9.1 42.55,36.83 | 42.55,36.83 R1.1 | 42.55,36.83 42.55,38.73 43.81,40.01 43.81,42.55 SWD.4 v50.16,42.55 | IC3.17 20.41,24.04 v20.95,23.5
  Bottom 0.305: v20.95,23.5 37.47,23.5 40.01,26.04 46.99,26.04 50.16,29.21 v50.16,42.55
P9
  Top 0.254: IC3.46 30.04,10.98 27.94,8.89 24.13,8.89 23.5,8.26 I2C.1
P10
  Top 0.254: IC3.47 30.54,10.85 27.94,8.26 26.67,8.26 26.04,7.62 I2C.2
P27  (via drill 0.6)
  Top 0.305: IC3.49 31.54,16.73 33.02,15.24 v33.02,10.79 | U1.1 42.96,9.3 v41.91,8.26
  Bottom 0.305: v33.02,10.79 35.56,8.26 v41.91,8.26
P28  (via drill 0.6)
  Top 0.305: IC3.48 31.04,15.96 31.75,15.24 v31.75,10.79 | U1.5 40.36,9.17 40.64,8.89 v40.64,6.99
  Bottom 0.305: v31.75,10.79 31.75,9.53 34.29,6.99 v40.64,6.99

### Text on the board
_tsilk: ARM Cortex M3 100MHz | RX | TX | ISP | NRESET | Vin | P26 | GND | 3.3 | 5.0 | P21 | P15 | P18 | SDA | SCL | P9 | P10 | Sam Clarke 2013